# Altium schematic sheet TM_Acondicionation.SchDoc
size 431 x 279 mm; Organization: ORGANIZATION; Address1: ADDRESS 1; Address2: ADDRESS 2; Address3: ADDRESS 3; Address4: ADDRESS 4; Revision: -; SheetNumber: 5; SheetTotal: 19; ENG_APP_DATE: --/--/--; DSN_APP_DATE: --/--/--; CHK_APP_DATE: --/--/--
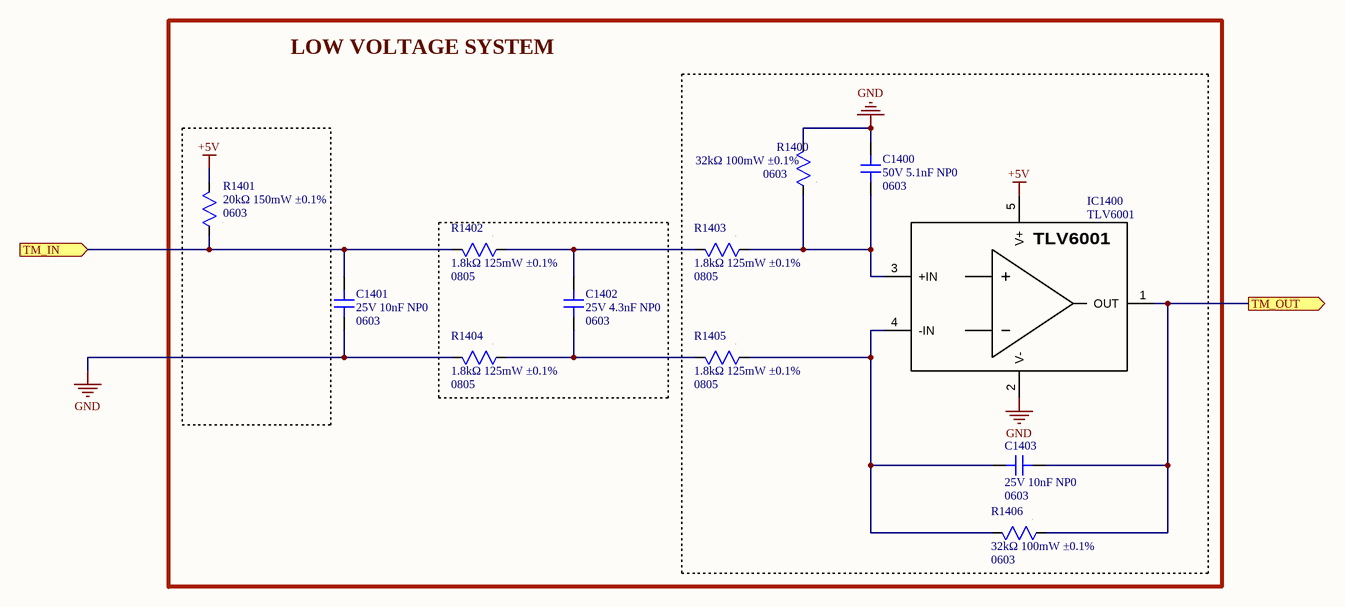
[diagram p0: TM_Acondicionation.SchDoc]

## Parts
C1400  value 50V 5.1nF NP0  Package: 0603  [CAP SMD 0603]  (hidden comment: CAP non polarized)
C1401  value 25V 10nF NP0  Package: 0603  [CAP SMD 0603]  (hidden comment: CAP non polarized)
C1402  value 25V 4.3nF NP0  Package: 0603  [CAP SMD 0603]  (hidden comment: CAP non polarized)
C1403  value 25V 10nF NP0  Package: 0603  [CAP SMD 0603]  (hidden comment: CAP non polarized)
IC1400  TLV6001  [SOT-23-5]
R1400  value 32kΩ 100mW ±0.1%  Package: 0603  [RES SMD 0603]  (hidden comment: RES)
R1401  value 20kΩ 150mW ±0.1%  Package: 0603  [RES SMD 0603]  (hidden comment: RES)
R1402  value 1.8kΩ 125mW ±0.1%  Package: 0805  [RES SMD 0805]  (hidden comment: RES)
R1403  value 1.8kΩ 125mW ±0.1%  Package: 0805  [RES SMD 0805]  (hidden comment: RES)
R1404  value 1.8kΩ 125mW ±0.1%  Package: 0805  [RES SMD 0805]  (hidden comment: RES)
R1405  value 1.8kΩ 125mW ±0.1%  Package: 0805  [RES SMD 0805]  (hidden comment: RES)
R1406  value 32kΩ 100mW ±0.1%  Package: 0603  [RES SMD 0603]  (hidden comment: RES)

## Blocks framed on the sheet
LOW VOLTAGE SYSTEM: C1400-C1403 IC1400 R1400-R1406

## Ports
TM_IN (in), TM_OUT (out)

## Nets
+5V: IC1400.5(V+) R1401.2
GND: C1400.1 C1401.2 IC1400.2(V-) R1400.2 R1404.2
TM_IN: C1401.1 R1401.1 R1402.2 ; port TM_IN
TM_OUT: C1403.2 IC1400.1(OUT) R1406.1 ; port TM_OUT
NetC1400_2: C1400.2 IC1400.3(+IN) R1400.1 R1403.1
NetC1402_1: C1402.1 R1402.1 R1403.2
NetC1402_2: C1402.2 R1404.1 R1405.2
NetC1403_1: C1403.1 IC1400.4(-IN) R1405.1 R1406.2

## Notes on the sheet
- DWG. NO.
- REV.
- SHT.
- THIS DOCUMENT AND THE DATA DISCLOSED HEREIN OR HEREWITH IS THE PROPERTY OF ALTIUM LIMITED AND MAY BE FREELY DISTRIBUTED IN WHOLE. NO RIGHTS ARE RESERVED OR EXPRESS OR IMPLIED WARANTEE GIVEN.
- REVISION
- DESCRIPTION
- DATE
- APPROVED
- ENG:
- APPROVALS
- PROJECT
- DSN:
- CHK:
- REFERENCE DOCUMENTS
- PROJECT REVISION:
- TITLE
- DOCUMENT REVISION:
- DESIGN ITEM:
- BOM:
- FAB DWG:
- PCB DWG:
- ASSY DWG:
- SCALE:
- SIZE
- B
- CAGE CODE
- FILE NAME
- DWG NO.
- SHEET
- OF
- REV

## Library data of the parts
C1400 C1401 = 001-0109: Condensadores de cerámica multicapa (MLCC- SMD/SMT) 50V 5100pF 0603 C0G 1%; MPN: C0603C512F5GACTU; Manufacturer: KEMET; ComponentLink1Description: Datasheet; ComponentLink1URL: https://www.mouser.es/datasheet/3/72/1/C0603C512F5GACTU.pdf; ComponentLink2Description: Distributor Link; ComponentLink2URL: https://www.mouser.es/ProductDetail/KEMET/C0603C512F5GACTU?qs=Fn3VdHBzkcmgqbeAGPfrXg%3D%3D; ID: 001-0109; Distributor PN: 80-C0603C512F5G; Distributor: Mouser
C1402 = 001-0128: Condensadores de cerámica multicapa (MLCC- SMD/SMT) 4300 pF 25 VDC 2% 0603 C0G (NP0); MPN: GRM1885C1E432GA01J; Manufacturer: muRata; ComponentLink1Description: Datasheet; ComponentLink1URL: https://www.mouser.es/datasheet/3/76/1/GRM1885C1E432GA01-01A.pdf; ComponentLink2Description: Distributor Link; ComponentLink2URL: https://www.mouser.es/ProductDetail/Murata-Electronics/GRM1885C1E432GA01J?qs=QzBtWTOodeWyXLs1jqPc7Q%3D%3D; ID: 001-0128; Distributor PN: 81-GRM1885C1E432GA1J; Distributor: Mouser
C1403 = 001-0107: Condensadores de cerámica multicapa (MLCC- SMD/SMT) 0.01 uF 25 VDC 1% 0603 C0G (NP0) AEC-Q200; MPN: GRT1885C1E103FA02D; Manufacturer: muRata; ComponentLink1Description: Datasheet; ComponentLink1URL: https://www.mouser.es/datasheet/3/76/2/GRT1885C1E103FA02_01A.pdf; ComponentLink2Description: Distributor Link; ComponentLink2URL: https://www.mouser.es/ProductDetail/Murata-Electronics/GRT1885C1E103FA02D?qs=xZ%2FP%252Ba9zWqaqiXqJj78%252Bmg%3D%3D; ID: 001-0107; Distributor PN: 81-GRT1885C1E103FA2D; Distributor: Mouser
IC1400 = 062-0002: Amplificadores operacionales - Op Amps Single 5.5-V 1-MHz R RIO operational a A A 595-TLV6001UIDBVT; MPN: TLV6001UIDBVR; Manufacturer: Texas Instruments; ID: 062-0002; ComponentLink1URL: https://www.ti.com/lit/ds/symlink/tlv6001.pdf?ts=1781607824916&ref_url=https%253A%252F%252Fcz.mouser.com%252F; ComponentLink2URL: https://www.mouser.es/ProductDetail/Texas-Instruments/TLV6001UIDBVR?qs=8N88piwwHEgntIgM8jjJ5Q%3D%3D; Value: -; Package: SOT-23-5; Distributor PN: 595-TLV6001UIDBVR; Distributor: Mouser
R1400 R1406 = 010-0180: Resistores de película fina - SMD 1/10W 32K Ohms 0.1%; MPN: RT0603BRD0732KL; Manufacturer: YAGEO; ComponentLink1Description: Datasheet; ComponentLink1URL: https://www.mouser.es/datasheet/3/72/1/PYU_RT_1_TO_0_01_ROHS_L.pdf; ComponentLink2Description: Distributor Link; ID: 010-0180; Distributor PN: 603-RT0603BRD0732KL; Distributor: Mouser
R1401 = 010-0183: Resistores de película fina - SMD RQ 0603 20K 0.1% 10PPM 5K RL; MPN: RQ73C1J20KBTD; Manufacturer: TE Connectivity / Holsworthy; ComponentLink1Description: Datasheet; ComponentLink1URL: https://www.te.com/commerce/DocumentDelivery/DDEController?Action=showdoc&DocId=Data+Sheet%7F1773270-2%7FA%7Fpdf%7FEnglish%7FENG_DS_1773270-2_A.pdf%7F2176380-2086; ComponentLink2Description: Distributor Link; ComponentLink2URL: https://www.mouser.es/ProductDetail/TE-Connectivity-Holsworthy/RQ73C1J20KBTD?qs=gZXFycFWdAPzh65iaC%2FK3A%3D%3D; ID: 010-0183; Distributor PN: 279-RQ73C1J20KBTD; Distributor: Mouser
R1402-R1405 = 010-0162: Thin Film Resistors 0805 1.8Kohm 0.1% 10ppm AEC-Q200; MPN: ERA-6ARB182V; Manufacturer: Panasonic; ComponentLink1Description: Datasheet; ComponentLink1URL: https://industrial.panasonic.com/cdbs/www-data/pdf/RDM0000/AOA0000C307.pdf; ComponentLink2Description: Distributor Link; ComponentLink2URL: https://www.mouser.es/ProductDetail/Panasonic/ERA-6ARB182V?qs=sGAEpiMZZMvdGkrng054t7Q%2FBjLwFmgiTwW2qqIgdzU%3D; ID: 010-0162; Distributor PN: 667-ERA-6ARB182V; Distributor: Mouser